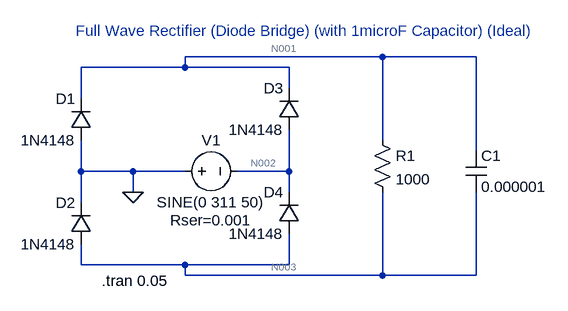
[diagram p0: schematic Assignment 4b (iii).asc]
Assignment 4b (iii).asc, the LTspice schematic file:
Version 4
SHEET 1 880 680
WIRE 368 80 64 80
WIRE 512 80 368 80
WIRE 64 96 64 80
WIRE 64 96 -96 96
WIRE 224 96 64 96
WIRE 224 128 224 96
WIRE -96 144 -96 96
WIRE 368 208 368 80
WIRE 512 224 512 80
WIRE -96 256 -96 208
WIRE -16 256 -96 256
WIRE 64 256 -16 256
WIRE 224 256 224 192
WIRE 224 256 144 256
WIRE -16 288 -16 256
WIRE 224 288 224 256
WIRE -96 304 -96 256
WIRE -96 400 -96 368
WIRE 64 400 -96 400
WIRE 224 400 224 352
WIRE 224 400 64 400
WIRE 64 416 64 400
WIRE 368 416 368 288
WIRE 368 416 64 416
WIRE 512 416 512 288
WIRE 512 416 368 416
FLAG -16 288 0
SYMBOL voltage 48 256 R270
WINDOW 0 32 56 VTop 2
WINDOW 3 -32 56 VBottom 2
WINDOW 123 0 0 Left 2
WINDOW 39 -60 56 VBottom 2
SYMATTR InstName V1
SYMATTR Value SINE(0 311 50)
SYMATTR SpiceLine Rser=0.001
SYMBOL diode -80 208 R180
WINDOW 0 24 64 Left 2
WINDOW 3 24 0 Left 2
SYMATTR InstName D1
SYMATTR Value 1N4148
SYMBOL diode -80 368 R180
WINDOW 0 24 64 Left 2
WINDOW 3 24 0 Left 2
SYMATTR InstName D2
SYMATTR Value 1N4148
SYMBOL diode 240 192 R180
WINDOW 0 24 64 Left 2
WINDOW 3 24 0 Left 2
SYMATTR InstName D3
SYMATTR Value 1N4148
SYMBOL diode 240 352 R180
WINDOW 0 24 64 Left 2
WINDOW 3 24 0 Left 2
SYMATTR InstName D4
SYMATTR Value 1N4148
SYMBOL res 352 192 R0
SYMATTR InstName R1
SYMATTR Value 1000
SYMBOL cap 496 224 R0
SYMATTR InstName C1
SYMATTR Value 0.000001
TEXT -64 424 Left 2 !.tran 0.05
TEXT -104 40 Left 2 ;Full Wave Rectifier (Diode Bridge) (with 1microF Capacitor) (Ideal)

The netlist it stands for:
* Assignment 4b (iii).asc
V1 0 N002 SINE(0 311 50) Rser=0.001
D1 0 N001 1N4148
D2 N003 0 1N4148
D3 N002 N001 1N4148
D4 N003 N002 1N4148
R1 N001 N003 1000
C1 N001 N003 0.000001
.model D D
.lib standard.dio
.tran 0.05
* Full Wave Rectifier (Diode Bridge) (with 1microF Capacitor) (Ideal)
.backanno
.end

* Results of the author's LTspice run, read from the files saved beside the schematic
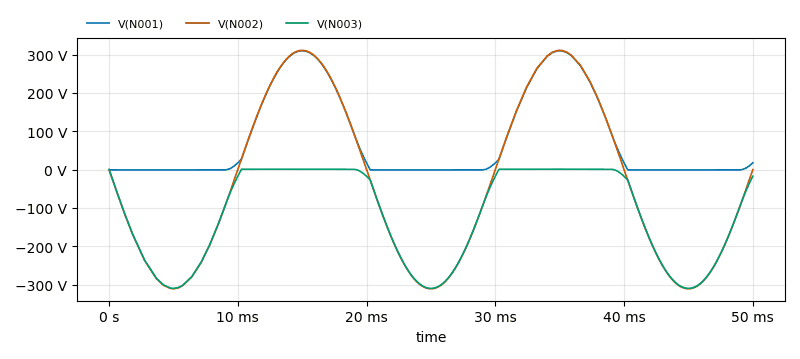
[diagram p1: Transient Analysis of Assignment 4b (iii).asc, plotted from the saved traces]
* Transient Analysis, 1 run:
*   V(N001): min -1.03 V, max 310 V, average 79 V, rms 138.6 V, last 17.62 V
*   V(N002): min -311 V, max 311 V, average -39.58 V, rms 219.8 V, last 0 V
*   V(N003): min -310 V, max 1.03 V, average -118.6 V, rms 169.7 V, last -17.31 V